# Altium schematic sheet Buck.SchDoc
size A4; SheetNumber: 1; SheetTotal: 4
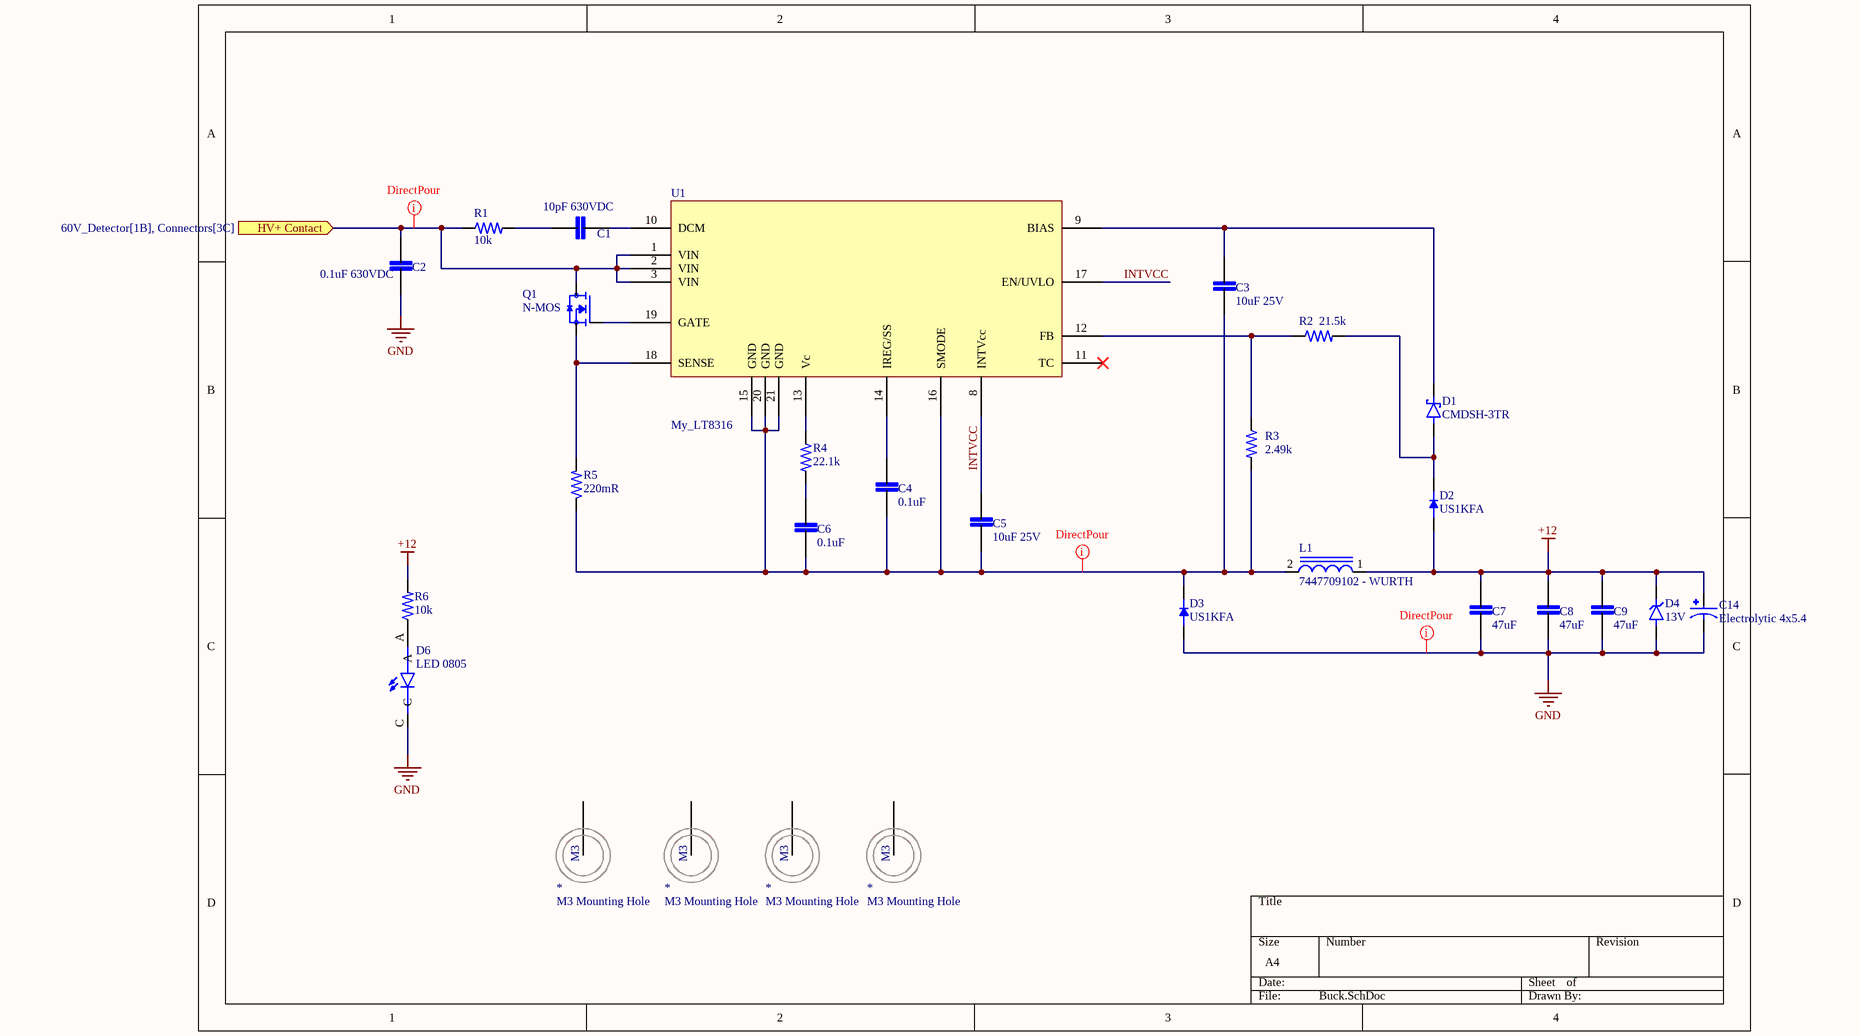
[diagram p0: Buck.SchDoc]

## Parts
(Parts that share a designator on the sheet are numbered #1, #2 ... from top to bottom, then left to right.)
*#1  M3 Mounting Hole  [M3 - Mounting Hole]
*#2  M3 Mounting Hole  [M3 - Mounting Hole]
*#3  M3 Mounting Hole  [M3 - Mounting Hole]
*#4  M3 Mounting Hole  [M3 - Mounting Hole]
C1  10pF 630VDC  [0805]
C2  0.1uF 630VDC  [1812]
C3  10uF 25V  [0805]
C4  0.1uF  [0805]
C5  10uF 25V  [0805]
C6  0.1uF  [0805]
C7  47uF  [0805]
C8  47uF  [0805]
C9  47uF  [0805]
C14  Electrolytic 4x5.4  [Electrolytic 4x5.4]
D1  CMDSH-3TR  [SOD-323]
D2  US1KFA  [SOD123]
D3  US1KFA  [SOD123]
D4  13V  [SOD123]
D6  LED 0805  [LED 0805]
L1  7447709102 - WURTH  [7447709102 - WURTH]
Q1  N-MOS  [DPAK - MOSFET]
R1  10k  [0805]
R2  21.5k  [0805]
R3  2.49k  [0805]
R4  22.1k  [0805]
R5  220mR  [0805]
R6  10k  [0805]
U1  My_LT8316  [IC_LT8316EFE#PBF]

## Ports
HV+ Contact (in, see 60V_Detector[1B], Connectors[3C])

## Nets
+12: C7.2 C8.2 C9.2 C14.1 D2.1(K) D4.1(K) L1.1 R6.2
GND: C2.1 C7.1 C8.1 C9.1 C14.2 D3.1(K) D4.2(A) D6.C
HV+ Contact: C2.2 Q1.3(D) R1.1 U1.1(VIN) U1.2(VIN) U1.3(VIN) ; port HV+ Contact
INTVCC: C5.1 U1.8(INTVcc) U1.17(EN/UVLO)
NetC1_1: C1.1 R1.2
NetC1_2: C1.2 U1.10(DCM)
NetC3_1: C3.1 D1.C U1.9(BIAS)
NetC3_2: C3.2 C4.1 C5.2 C6.1 D3.2(A) L1.2 R3.2 R5.1 U1.15(GND) U1.16(SMODE) U1.20(GND) U1.21(GND)
NetC4_2: C4.2 U1.14(IREG/SS)
NetC6_2: C6.2 R4.2
NetD1_A: D1.A D2.2(A) R2.2
NetD6_A: D6.A R6.1
NetQ1_1: Q1.1(G) U1.19(GATE)
NetQ1_2: Q1.2(S) R5.2 U1.18(SENSE)
NetR2_1: R2.1 R3.1 U1.12(FB)
NetR4_1: R4.1 U1.13(Vc)

Not connected (* = marked no-connect by the designer): *#1 1(M3); *#2 1(M3); *#3 1(M3); *#4 1(M3); U1 11(TC)*

## Layout directives
net class DirectPour: GND, HV+ Contact, NetC3_2

## Library data of the parts
C1 C3-C9 = 0805_Capacitor: MP: LD051A121KAB2A; MF: AVX; SnapEDA_Link: https://www.snapeda.com/parts/LD051A121KAB2A/AVX/view-part/?ref=snap; Package: 0805 AVX; Check_prices: https://www.snapeda.com/parts/LD051A121KAB2A/AVX/view-part/?ref=eda; Purchase-URL: https://pricing.snapeda.com/search/part/LD051A121KAB2A/?ref=eda; Price: None; Value: *; Availability: In Stock
C2 = 1812_Capacitor: MP: LD051A121KAB2A; MF: AVX; SnapEDA_Link: https://www.snapeda.com/parts/LD051A121KAB2A/AVX/view-part/?ref=snap; Package: 0805 AVX; Check_prices: https://www.snapeda.com/parts/LD051A121KAB2A/AVX/view-part/?ref=eda; Purchase-URL: https://pricing.snapeda.com/search/part/LD051A121KAB2A/?ref=eda; Price: None; Value: *; Availability: In Stock
C14 = Electrolytic 4x5.4: MF: Panasonic; MP: EEE-HA1E100WR; Package: RADIAL-2 Panasonic; Check_prices: https://www.snapeda.com/parts/EEE-HA1E100WR/Panasonic/view-part/778519/?ref=eda; Value: *; Price: None; Purchase-URL: https://pricing.snapeda.com/search/part/EEE-HA1E100WR/?ref=eda; SnapEDA_Link: https://www.snapeda.com/parts/EEE-HA1E100WR/Panasonic/view-part/778519/?ref=snap; Availability: In Stock
D1 = CMDSH-3TR: Diode Schottky 30V 100mA Surface Mount SOD-323; MF: Central Semiconductor; Value: *; Package: SOD-323 Central Semiconductor; MP: CMDSH-3 TR; Price: None; SnapEDA_Link: https://www.snapeda.com/parts/CMDSH-3%20TR/Central%20Semiconductor%20Corp/view-part/447234/?ref=snap; Availability: Unavailable
D2 D3 = SOD123 - Rectifier Diode: MF: Diodes Inc.; MP: 1N4148W-7-F; Value: *; Availability: In Stock; Package: SOD-123 Fairchild Semiconductor; SnapEDA_Link: https://www.snapeda.com/parts/1N4148W-7-F/Diodes+Inc./view-part/?ref=snap; Price: None; Check_prices: https://www.snapeda.com/parts/1N4148W-7-F/Diodes+Inc./view-part/?ref=eda; Purchase-URL: https://pricing.snapeda.com/search/part/1N4148W-7-F/?ref=eda
D4 = SOD123 - Zener Diode: MP: 1SMA5926; MF: Taiwan Semiconductor; Package: SMA-2 Taiwan Semiconductor; Availability: In Stock; Purchase-URL: https://pricing.snapeda.com/search/part/1SMA5926/?ref=eda; SnapEDA_Link: https://www.snapeda.com/parts/1SMA5926/Taiwan+Semiconductor/view-part/?ref=snap; Price: None; Check_prices: https://www.snapeda.com/parts/1SMA5926/Taiwan+Semiconductor/view-part/?ref=eda; Value: *
D6 = LED 0805: LED Uni-Color Green 4-Pin Chip 0805 T/R; MP: 597-3305-607F; Availability: Unavailable; Value: *; Price: None; Package: None
L1 = 7447709102 - WURTH: 1000uH - 900mA; MF: Bourns; MP: SRR1260-680M; Package: Nonstandard Bourns; Value: *; Digi-Key_Purchase_URL: https://www.digikey.com/product-detail/en/bourns-inc/SRR1260-680M/SRR1260-680MCT-ND/2127423?utm_source=snapeda&utm_medium=aggregator&utm_campaign=symbol; Digi-Key_Part_Number: SRR1260-680MCT-ND; SnapEDA_Link: https://www.snapeda.com/parts/SRR1260-680M/Bourns/view-part/337191/?ref=snap
Q1 = N-MOS: D-PAK; MP: AO3402; MF: Alpha &; Digi-Key_Purchase_URL: https://www.digikey.ca/product-detail/en/alpha-omega-semiconductor-inc/AO3402/785-1002-1-ND/1855944?utm_source=snapeda&utm_medium=aggregator&utm_campaign=symbol; Value: *; Package: SOT-23 Alpha &amp; Omega Semiconductor; SnapEDA_Link: https://www.snapeda.com/parts/AO3402/Alpha%20&%20Omega%20Semiconductor%20Inc./view-part/564857/?ref=snap; Digi-Key_Part_Number: 785-1002-1-ND
R1-R6 = 0805_Resistor: Power_Rating: .25 W; MP: 2-2176053-0; Tolerance: 1%; Resistance: .33; MF: TE Connectivity; Price: None; Availability: In Stock; EU_RoHS_Compliance: Compliant with Exemptions; Package: 0805; Value: *; SnapEDA_Link: https://www.snapeda.com/parts/2-2176053-0/TE+Connectivity/view-part/?ref=snap; Check_prices: https://www.snapeda.com/parts/2-2176053-0/TE+Connectivity/view-part/?ref=eda